# Altium schematic sheet Panel.SchDoc
size A4
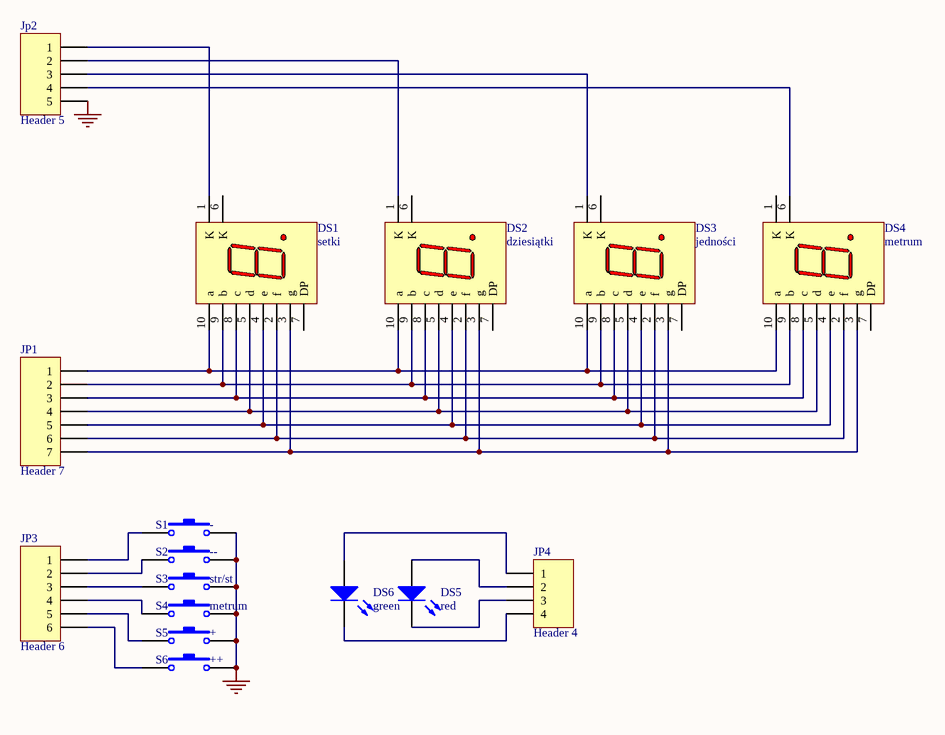
[diagram p0: Panel.SchDoc]

## Parts
DS1  setki  [LEDDIP-10/C5.08]
DS2  dziesiątki  [LEDDIP-10/C5.08]
DS3  jedności  [LEDDIP-10/C5.08]
DS4  metrum  [LEDDIP-10/C5.08]
DS5  red  [LED-1]
DS6  green  [LED-1]
JP1  Header 7  [HDR1X7]
Jp2  Header 5  [HDR1X5]
JP3  Header 6  [HDR1X6]
JP4  Header 4  [HDR1X4]
S1  -  [SPST-2]
S2  --  [SPST-2]
S3  str/st  [SPST-2]
S4  metrum  [SPST-2]
S5  +  [SPST-2]
S6  ++  [SPST-2]

## Nets
GND: Jp2.5 S1.2 S2.2 S3.2 S4.2 S5.2 S6.2
NetDS1_1: DS1.1(K) Jp2.1
NetDS1_2: DS1.2(f) DS2.2(f) DS3.2(f) DS4.2(f) JP1.6
NetDS1_3: DS1.3(g) DS2.3(g) DS3.3(g) DS4.3(g) JP1.7
NetDS1_4: DS1.4(e) DS2.4(e) DS3.4(e) DS4.4(e) JP1.5
NetDS1_5: DS1.5(d) DS2.5(d) DS3.5(d) DS4.5(d) JP1.4
NetDS1_8: DS1.8(c) DS2.8(c) DS3.8(c) DS4.8(c) JP1.3
NetDS1_9: DS1.9(b) DS2.9(b) DS3.9(b) DS4.9(b) JP1.2
NetDS1_10: DS1.10(a) DS2.10(a) DS3.10(a) DS4.10(a) JP1.1
NetDS2_1: DS2.1(K) Jp2.2
NetDS3_1: DS3.1(K) Jp2.3
NetDS4_6: DS4.6(K) Jp2.4
NetDS5_1: DS5.1(A) JP4.2
NetDS5_2: DS5.2(K) JP4.3
NetDS6_1: DS6.1(A) JP4.1
NetDS6_2: DS6.2(K) JP4.4
NetJP3_1: JP3.1 S1.1
NetJP3_2: JP3.2 S2.1
NetJP3_3: JP3.3 S3.1
NetJP3_4: JP3.4 S4.1
NetJP3_5: JP3.5 S5.1
NetJP3_6: JP3.6 S6.1

Not connected (* = marked no-connect by the designer): DS1 6(K) 7(DP); DS2 6(K) 7(DP); DS3 6(K) 7(DP); DS4 1(K) 7(DP)

## Library data of the parts
DS1-DS4 = Dpy Red-CC: 7.6 mm Black Surface 7-Segment Display: CC, RH DP; Package Information: Latest Revision: 19-Feb-2002; Min. Intensity: 360 ucd; Note: IF = 5 mA; Colour: HE Red; Note: Pins 1 and 6 are redundant Cathodes.; Datasheet: Latest Revision: 19-Feb-2002; Package Reference: A; Publisher: Altium Limited
DS5 DS6 = LED1: Typical RED GaAs LED; Published: 8-Jun-2000; Revision: July-2002: Re-released for DXP Platform.; Publisher: Altium Limited
JP1 = Header 7: Header, 7-Pin; Revision: 17-Jul-2002: Re-released for DXP Platform.; Publisher: Altium Limited
Jp2 = Header 5: Header, 5-Pin; Revision: 17-Jul-2002: Re-released for DXP Platform.; Publisher: Altium Limited
JP3 = Header 6: Header, 6-Pin; Revision: 17-Jul-2002: Re-released for DXP Platform.; Publisher: Altium Limited
JP4 = Header 4: Header, 4-Pin; Revision: 17-Jul-2002: Re-released for DXP Platform.; Publisher: Altium Limited
S1-S6 = SW-PB: Switch; Published: 24-Mar-1999; Revision: July-2002: Re-released for DXP Platform.; Publisher: Altium Limited